# EAGLE schematic M_B_adapter-rotated (EAGLE 9.6.2)
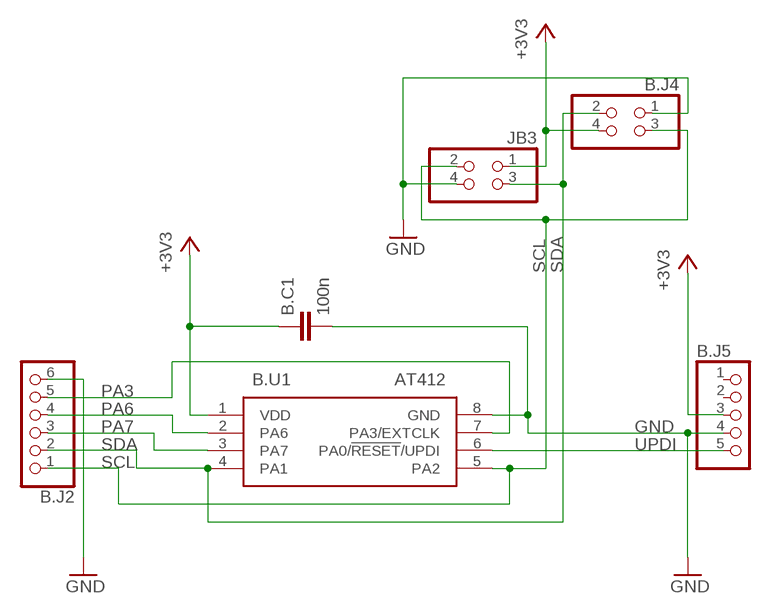
[diagram p0: schematic, sheet 1]

## Parts
B.C1  100n  C-EUC0603  [C0603]
B.J2  PINHD-1X6  [1X06]
B.J4  PINHD-2X2  [2X02]
B.J5  PINHD-1X5  [1X05]
B.U1  AT412  ATTINY412-SSN  [SOIC127P600X175-8N]
JB3  PINHD-2X2  [2X02]

## Nets
3V3: B.C1.1 B.J4.4 B.J5.3 B.U1.1(VDD) JB3.1 ; supply symbol labelled +3V3
GND: B.C1.2 B.J2.6 B.J4.1 B.J5.4 B.U1.8(GND) JB3.4
PA3: B.J2.5 B.U1.7(PA3/EXTCLK)
PA6: B.J2.4 B.U1.2(PA6)
PA7: B.J2.3 B.U1.3(PA7)
SCL: B.J2.1 B.J4.3 B.U1.5(PA2) JB3.2
SDA: B.J2.2 B.J4.2 B.U1.4(PA1) JB3.3
UPDI: B.J5.5 B.U1.6(PA0/!RESET!/UPDI)
Unconnected: B.J5.1 B.J5.2

## Library data of the parts
B.C1 = rcl:C-EU: CAPACITOR, European symbol; SPICEPREFIX: C
B.J2 = pinhead2:PINHD-1X6: PIN HEADER
B.J4 JB3 = pinhead2:PINHD-2X2: PIN HEADER
B.J5 = pinhead2:PINHD-1X5: PIN HEADER
B.U1 = ATTINY412-SSN:ATTINY412-SSN: 8-bit Microcontrollers - MCU 20MHz, 4KB, SOIC8, Ind 105C, Green, Tube Source: Datasheet <http://www.microchip.com/mymicrochip/filehandler.aspx?ddocname=en599382>; DESCRIPTION: 8-bit Microcontrollers - MCU 20MHz, 4KB, SOIC8, Ind 105C, Green, Tube; HEIGHT: 1.75mm; MANUFACTURER_NAME: Microchip; MANUFACTURER_PART_NUMBER: ATTINY412-SSN; MOUSER_PART_NUMBER: 579-ATTINY412-SSN; MOUSER_PRICE-STOCK: https://www.mouser.co.uk/ProductDetail/Microchip-Technology/ATTINY412-SSN?qs=3HJ2avRr9PItQG9ZsCamPQ%3D%3D